# Altium schematic sheet Connectors.SchDoc
size A3
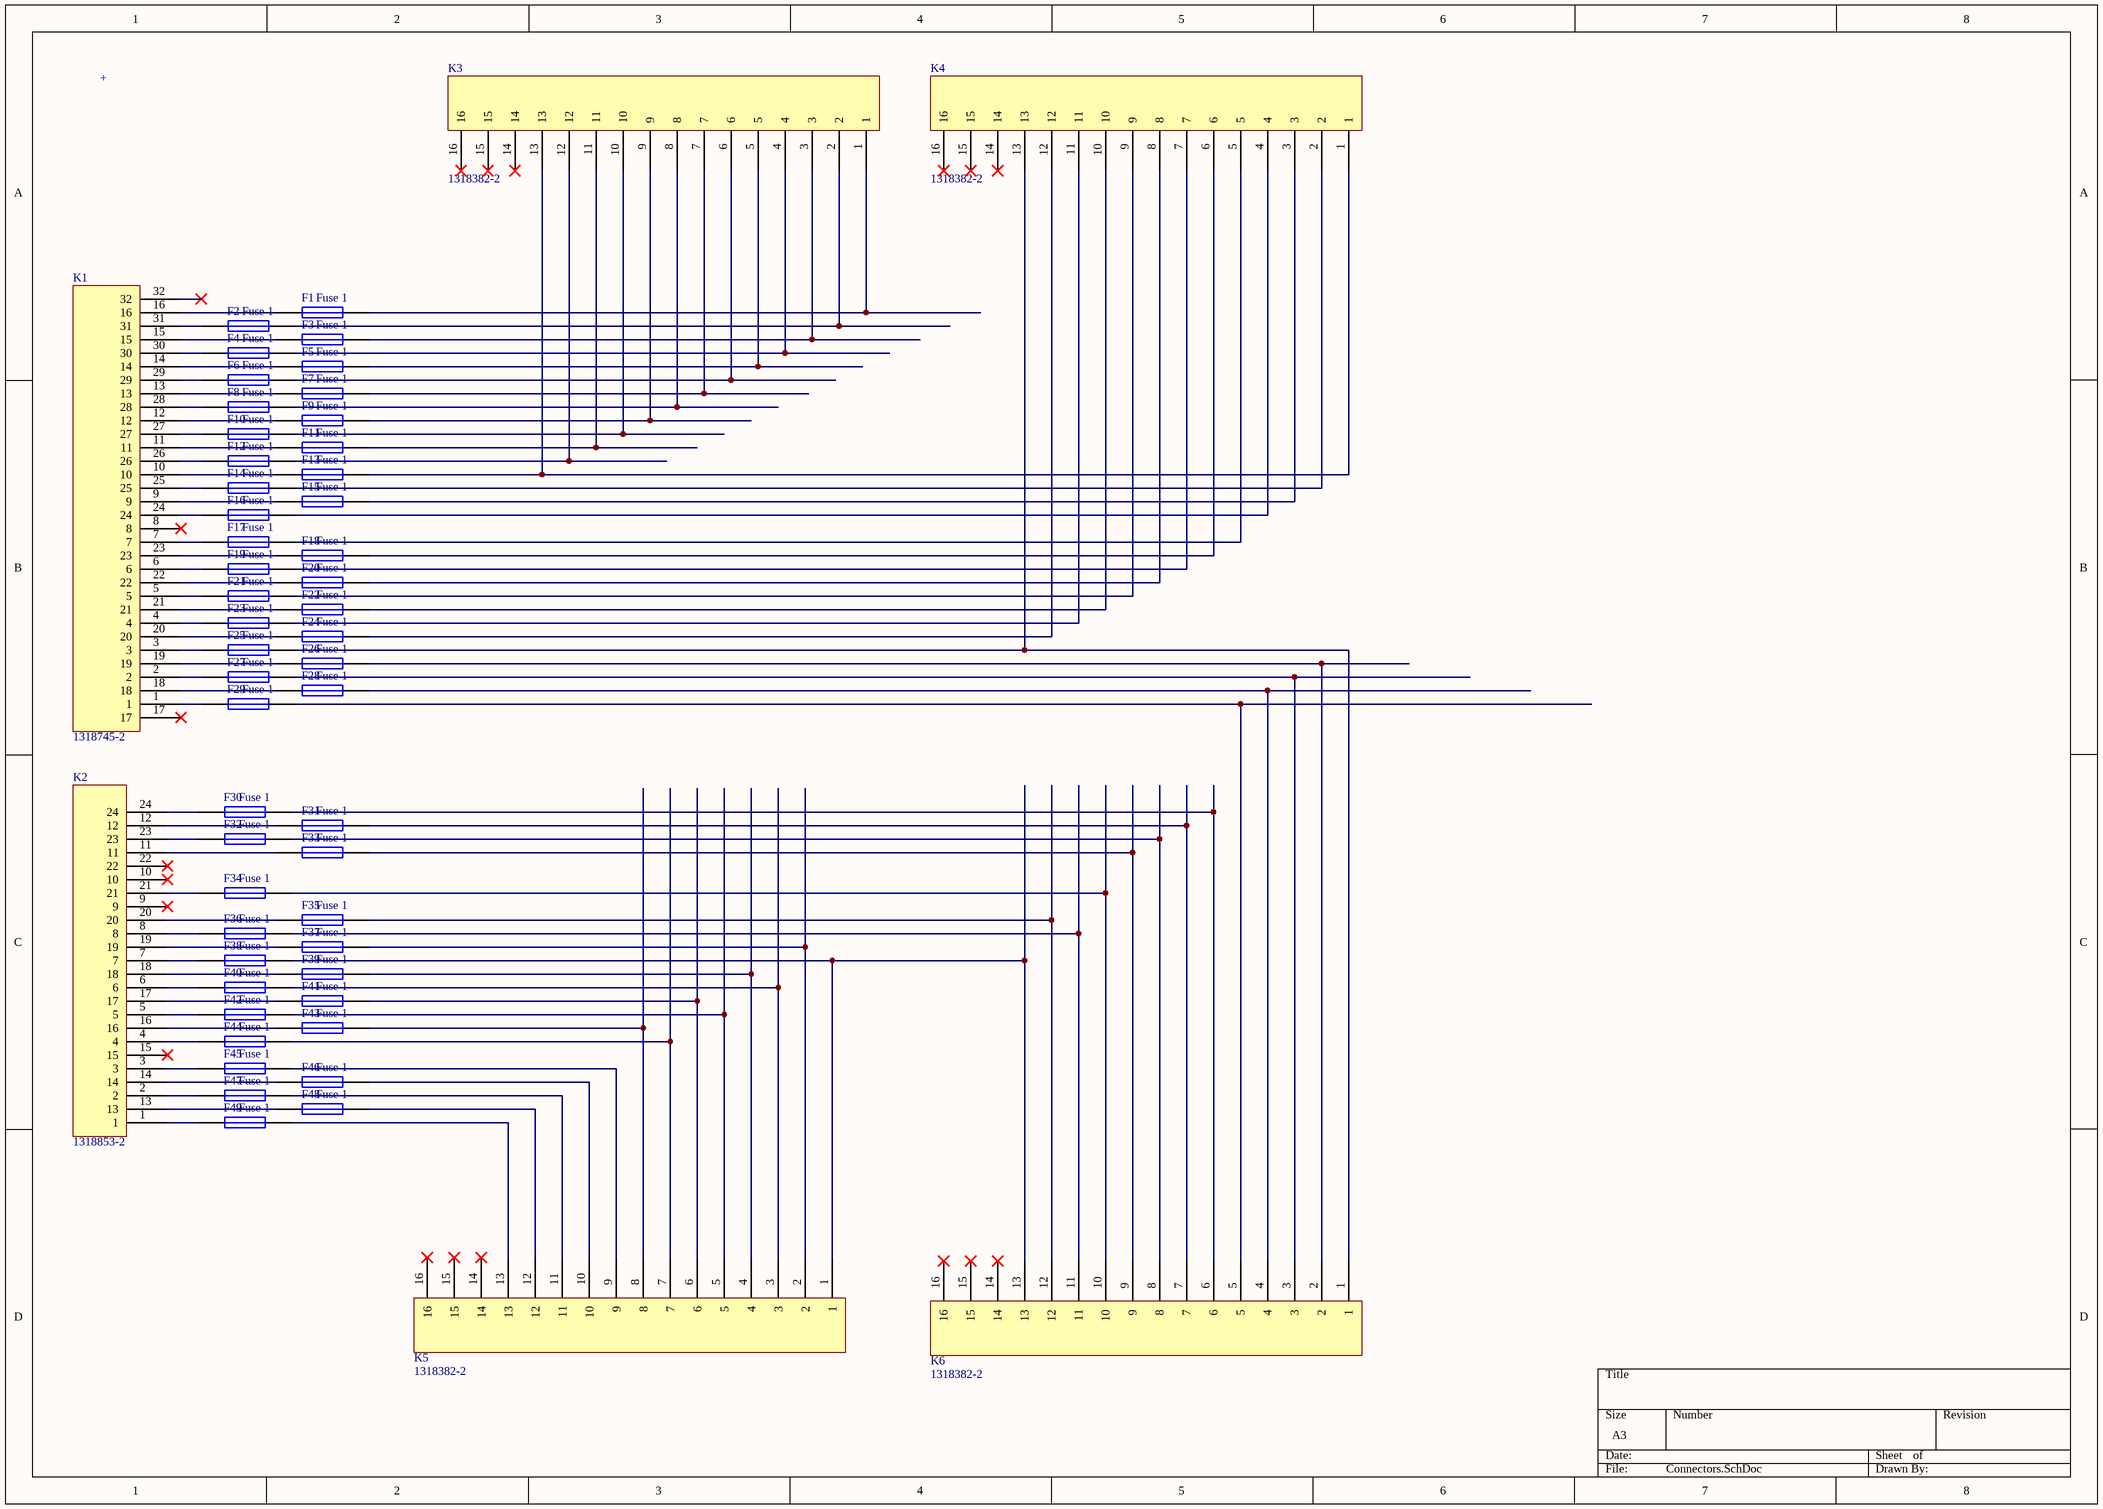
[diagram p0: Connectors.SchDoc]

## Parts
F1  Fuse 1  [C1206]
F2  Fuse 1  [C1206]
F3  Fuse 1  [C1206]
F4  Fuse 1  [C1206]
F5  Fuse 1  [C1206]
F6  Fuse 1  [C1206]
F7  Fuse 1  [C1206]
F8  Fuse 1  [C1206]
F9  Fuse 1  [C1206]
F10  Fuse 1  [C1206]
F11  Fuse 1  [C1206]
F12  Fuse 1  [C1206]
F13  Fuse 1  [C1206]
F14  Fuse 1  [C1206]
F15  Fuse 1  [C1206]
F16  Fuse 1  [C1206]
F17  Fuse 1  [C1206]
F18  Fuse 1  [C1206]
F19  Fuse 1  [C1206]
F20  Fuse 1  [C1206]
F21  Fuse 1  [C1206]
F22  Fuse 1  [C1206]
F23  Fuse 1  [C1206]
F24  Fuse 1  [C1206]
F25  Fuse 1  [C1206]
F26  Fuse 1  [C1206]
F27  Fuse 1  [C1206]
F28  Fuse 1  [C1206]
F29  Fuse 1  [C1206]
F30  Fuse 1  [C1206]
F31  Fuse 1  [C1206]
F32  Fuse 1  [C1206]
F33  Fuse 1  [C1206]
F34  Fuse 1  [C1206]
F35  Fuse 1  [C1206]
F36  Fuse 1  [C1206]
F37  Fuse 1  [C1206]
F38  Fuse 1  [C1206]
F39  Fuse 1  [C1206]
F40  Fuse 1  [C1206]
F41  Fuse 1  [C1206]
F42  Fuse 1  [C1206]
F43  Fuse 1  [C1206]
F44  Fuse 1  [C1206]
F45  Fuse 1  [C1206]
F46  Fuse 1  [C1206]
F47  Fuse 1  [C1206]
F48  Fuse 1  [C1206]
F49  Fuse 1  [C1206]
K1  1318745-2  [1318745-2]
K2  1318853-2  [1318853-2]
K3  1318382-2  [1318382-2]
K4  1318382-2  [1318382-2]
K5  1318382-2  [1318382-2]
K6  1318382-2  [1318382-2]

## Nets
NetF1_1: F1.1 K1.16
NetF1_2: F1.2 K3.1
NetF2_1: F2.1 K1.31
NetF2_2: F2.2 K3.2
NetF3_1: F3.1 K1.15
NetF3_2: F3.2 K3.3
NetF4_1: F4.1 K1.30
NetF4_2: F4.2 K3.4
NetF5_1: F5.1 K1.14
NetF5_2: F5.2 K3.5
NetF6_1: F6.1 K1.29
NetF6_2: F6.2 K3.6
NetF7_1: F7.1 K1.13
NetF7_2: F7.2 K3.7
NetF8_1: F8.1 K1.28
NetF8_2: F8.2 K3.8
NetF9_1: F9.1 K1.12
NetF9_2: F9.2 K3.9
NetF10_1: F10.1 K1.27
NetF10_2: F10.2 K3.10
NetF11_1: F11.1 K1.11
NetF11_2: F11.2 K3.11
NetF12_1: F12.1 K1.26
NetF12_2: F12.2 K3.12
NetF13_1: F13.1 K1.10
NetF13_2: F13.2 K3.13 K4.1
NetF14_1: F14.1 K1.25
NetF14_2: F14.2 K4.2
NetF15_1: F15.1 K1.9
NetF15_2: F15.2 K4.3
NetF16_1: F16.1 K1.24
NetF16_2: F16.2 K4.4
NetF17_1: F17.1 K1.7
NetF17_2: F17.2 K4.5
NetF18_1: F18.1 K1.23
NetF18_2: F18.2 K4.6
NetF19_1: F19.1 K1.6
NetF19_2: F19.2 K4.7
NetF20_1: F20.1 K1.22
NetF20_2: F20.2 K4.8
NetF21_1: F21.1 K1.5
NetF21_2: F21.2 K4.9
NetF22_1: F22.1 K1.21
NetF22_2: F22.2 K4.10
NetF23_1: F23.1 K1.4
NetF23_2: F23.2 K4.11
NetF24_1: F24.1 K1.20
NetF24_2: F24.2 K4.12
NetF25_1: F25.1 K1.3
NetF25_2: F25.2 K4.13 K6.1
NetF26_1: F26.1 K1.19
NetF26_2: F26.2 K6.2
NetF27_1: F27.1 K1.2
NetF27_2: F27.2 K6.3
NetF28_1: F28.1 K1.18
NetF28_2: F28.2 K6.4
NetF29_1: F29.1 K1.1
NetF29_2: F29.2 K6.5
NetF30_1: F30.1 K2.24
NetF30_2: F30.2 K6.6
NetF31_1: F31.1 K2.12
NetF31_2: F31.2 K6.7
NetF32_1: F32.1 K2.23
NetF32_2: F32.2 K6.8
NetF33_1: F33.1 K2.11
NetF33_2: F33.2 K6.9
NetF34_1: F34.1 K2.21
NetF34_2: F34.2 K6.10
NetF35_1: F35.1 K2.20
NetF35_2: F35.2 K6.12
NetF36_1: F36.1 K2.8
NetF36_2: F36.2 K6.11
NetF37_1: F37.1 K2.19
NetF37_2: F37.2 K5.2
NetF38_1: F38.1 K2.7
NetF38_2: F38.2 K5.1 K6.13
NetF39_1: F39.1 K2.18
NetF39_2: F39.2 K5.4
NetF40_1: F40.1 K2.6
NetF40_2: F40.2 K5.3
NetF41_1: F41.1 K2.17
NetF41_2: F41.2 K5.6
NetF42_1: F42.1 K2.5
NetF42_2: F42.2 K5.5
NetF43_1: F43.1 K2.16
NetF43_2: F43.2 K5.8
NetF44_1: F44.1 K2.4
NetF44_2: F44.2 K5.7
NetF45_1: F45.1 K2.3
NetF45_2: F45.2 K5.9
NetF46_1: F46.1 K2.14
NetF46_2: F46.2 K5.10
NetF47_1: F47.1 K2.2
NetF47_2: F47.2 K5.11
NetF48_1: F48.1 K2.13
NetF48_2: F48.2 K5.12
NetF49_1: F49.1 K2.1
NetF49_2: F49.2 K5.13

Not connected (* = marked no-connect by the designer): K1 8* 17* 32*; K2 9* 10* 15* 22*; K3 14* 15* 16*; K4 14* 15* 16*; K5 14* 15* 16*; K6 14* 15* 16*

## Notes on the sheet
- +

## Library data of the parts
F1-F49 = Fuse 1: Fuse; Published: 8-Jun-2000; LatestRevisionDate: 17-Jul-2002; LatestRevisionNote: Re-released for DXP Platform.; PackageReference: PIN-W2/E2.8; Publisher: Altium Limited; PackageDescription: Thru-Hole; 2 Leads